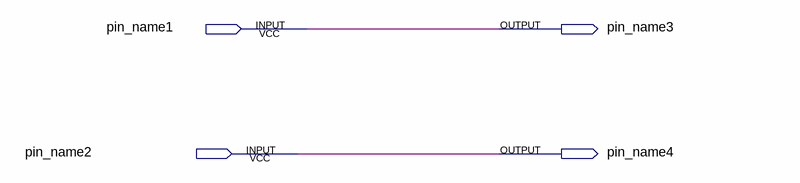
[diagram p0: schematic sheet]
// Quartus schematic pirtester.bdf as structural Verilog: 0 symbols, 4 pins
module pirtester (
  input  pin_name1,
  input  pin_name2,
  output pin_name3,
  output pin_name4
);


  assign pin_name3 = pin_name1;
  assign pin_name4 = pin_name2;
endmodule
